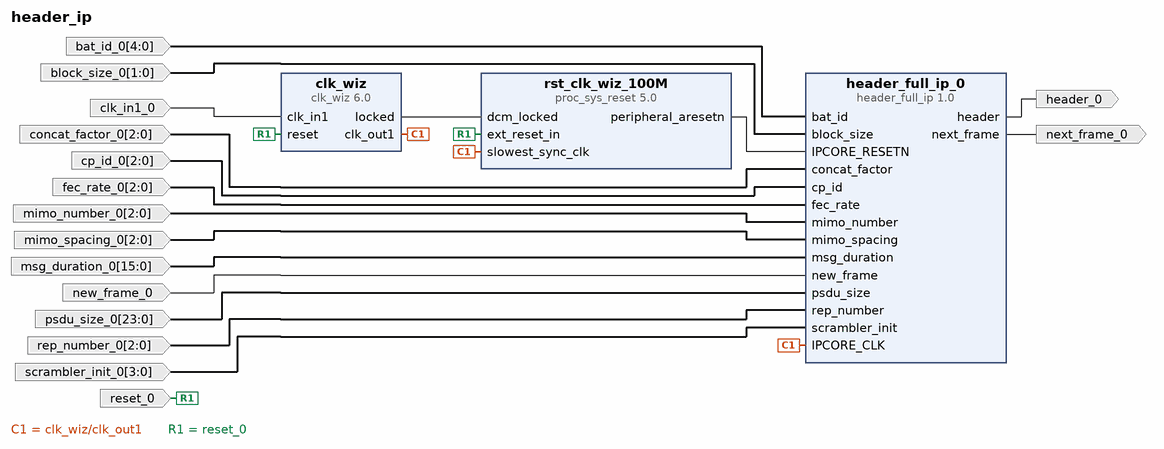
[diagram p0: block diagram of the top level]
# Vivado block design header_ip, xc7z010clg400-1, Vivado 2023.2
create_bd_design header_ip

create_bd_port -dir I -from 4 -to 0 bat_id_0
create_bd_port -dir I -from 1 -to 0 block_size_0
create_bd_port -dir I -from 2 -to 0 concat_factor_0
create_bd_port -dir I -from 2 -to 0 cp_id_0
create_bd_port -dir I -from 2 -to 0 fec_rate_0
create_bd_port -dir O header_0
create_bd_port -dir I -from 2 -to 0 mimo_number_0
create_bd_port -dir I -from 2 -to 0 mimo_spacing_0
create_bd_port -dir I -from 15 -to 0 msg_duration_0
create_bd_port -dir I new_frame_0
create_bd_port -dir O next_frame_0
create_bd_port -dir I -from 23 -to 0 psdu_size_0
create_bd_port -dir I -from 2 -to 0 rep_number_0
create_bd_port -dir I -from 3 -to 0 scrambler_init_0
create_bd_port -dir I -type clk clk_in1_0
create_bd_port -dir I -type rst reset_0
set_property -dict {CONFIG.POLARITY ACTIVE_HIGH} [get_bd_ports reset_0]

create_bd_cell -type ip -vlnv user.org:ip:header_full_ip:1.0 header_full_ip_0
create_bd_cell -type ip -vlnv xilinx.com:ip:clk_wiz:6.0 clk_wiz
create_bd_cell -type ip -vlnv xilinx.com:ip:proc_sys_reset:5.0 rst_clk_wiz_100M

# ---- connections ----

connect_bd_net -net bat_id_0_1 [get_bd_ports bat_id_0] [get_bd_pins header_full_ip_0/bat_id]
connect_bd_net -net block_size_0_1 [get_bd_ports block_size_0] [get_bd_pins header_full_ip_0/block_size]
connect_bd_net -net clk_in1_0_1 [get_bd_ports clk_in1_0] [get_bd_pins clk_wiz/clk_in1]
connect_bd_net [get_bd_pins clk_wiz/clk_out1] [get_bd_pins header_full_ip_0/IPCORE_CLK] [get_bd_pins rst_clk_wiz_100M/slowest_sync_clk]
connect_bd_net [get_bd_pins clk_wiz/locked] [get_bd_pins rst_clk_wiz_100M/dcm_locked]
connect_bd_net -net concat_factor_0_1 [get_bd_ports concat_factor_0] [get_bd_pins header_full_ip_0/concat_factor]
connect_bd_net -net cp_id_0_1 [get_bd_ports cp_id_0] [get_bd_pins header_full_ip_0/cp_id]
connect_bd_net -net fec_rate_0_1 [get_bd_ports fec_rate_0] [get_bd_pins header_full_ip_0/fec_rate]
connect_bd_net [get_bd_pins header_full_ip_0/header] [get_bd_ports header_0]
connect_bd_net [get_bd_pins header_full_ip_0/next_frame] [get_bd_ports next_frame_0]
connect_bd_net -net mimo_number_0_1 [get_bd_ports mimo_number_0] [get_bd_pins header_full_ip_0/mimo_number]
connect_bd_net -net mimo_spacing_0_1 [get_bd_ports mimo_spacing_0] [get_bd_pins header_full_ip_0/mimo_spacing]
connect_bd_net -net msg_duration_0_1 [get_bd_ports msg_duration_0] [get_bd_pins header_full_ip_0/msg_duration]
connect_bd_net -net new_frame_0_1 [get_bd_ports new_frame_0] [get_bd_pins header_full_ip_0/new_frame]
connect_bd_net -net psdu_size_0_1 [get_bd_ports psdu_size_0] [get_bd_pins header_full_ip_0/psdu_size]
connect_bd_net -net rep_number_0_1 [get_bd_ports rep_number_0] [get_bd_pins header_full_ip_0/rep_number]
connect_bd_net -net reset_0_1 [get_bd_ports reset_0] [get_bd_pins clk_wiz/reset] [get_bd_pins rst_clk_wiz_100M/ext_reset_in]
connect_bd_net [get_bd_pins rst_clk_wiz_100M/peripheral_aresetn] [get_bd_pins header_full_ip_0/IPCORE_RESETN]
connect_bd_net -net scrambler_init_0_1 [get_bd_ports scrambler_init_0] [get_bd_pins header_full_ip_0/scrambler_init]

validate_bd_design
save_bd_design
